# Altium project Z01-2.PrjPcb
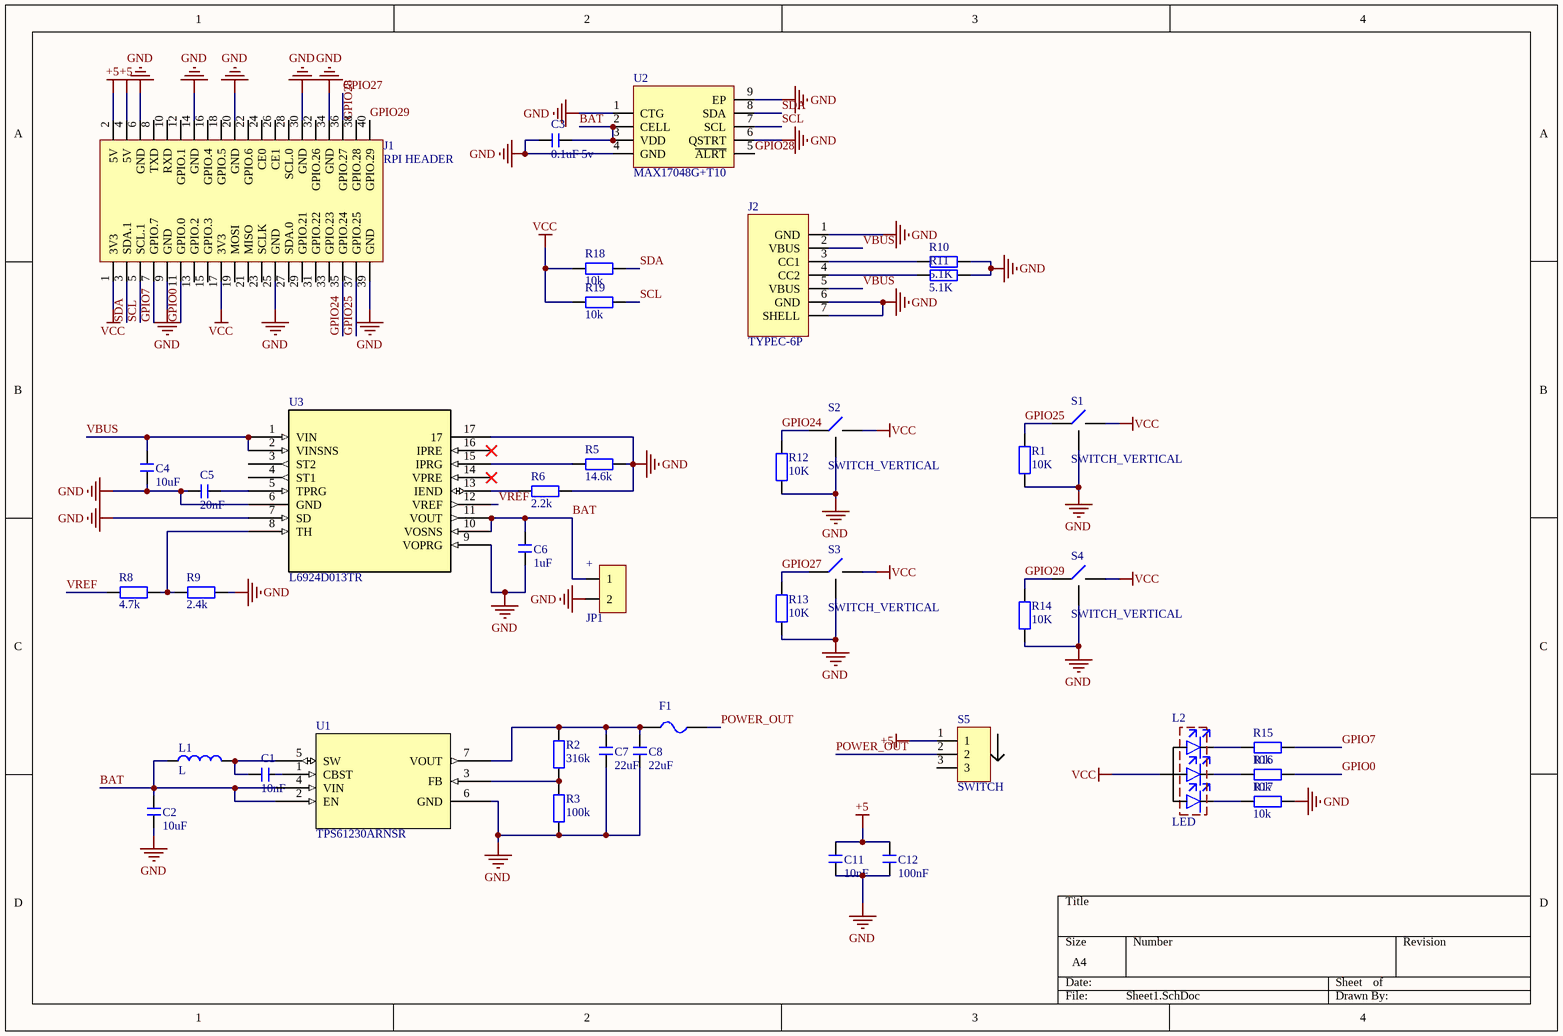
[diagram p0: Sheet1.SchDoc]
1 sheet, 41 parts. Net scope: global (net labels, ports and power ports of the same name join across sheets).
Board file: Z01-2.PcbDoc

## Sheet Sheet1.SchDoc
size A4; SheetNumber: 1; SheetTotal: 1

### Parts
C1  10nF  [C 0603_M]
C2  10uF  [C 0603_M]
C3  0.1uF 5v  [C 0603_M]
C4  10uF  [C 0603_M]
C5  20nF  [C 0603_M]
C6  1uF  [C 0603_M]
C7  22uF  [C 0603_M]
C8  22uF  [C 0603_M]
C11  10nF  [C 0603_M]
C12  100nF  [C 0603_M]
F1  MSMD200-8V 2A  [FU 1206]  (value not drawn)
J1  RPI HEADER  [HEADER 2*20 BACK]
J2  TYPEC-6P  [TYPEC-6P-SMD]
JP1  PH2.0 2P  [PH2.0 2P]  (value not drawn)
L1  L  [L SMD]
L2  LED  [FM-3510RGBA-SG]
R1  10K  [R 0603-HP]
R2  316k  [R 0603-HP]
R3  100k  [R 0603-HP]
R5  14.6k  [R 0603-HP]
R6  2.2k  [R 0603-HP]
R8  4.7k  [R 0603-HP]
R9  2.4k  [R 0603-HP]
R10  5.1K  [R 0603]
R11  5.1K  [R 0603]
R12  10K  [R 0603-HP]
R13  10K  [R 0603-HP]
R14  10K  [R 0603-HP]
R15  10k  [R 0603-HP]
R16  10k  [R 0603-HP]
R17  10k  [R 0603-HP]
R18  10k  [R 0603-HP]
R19  10k  [R 0603-HP]
S1  SWITCH_VERTICAL  [TA3-2W2-V-T/R]
S2  SWITCH_VERTICAL  [TA3-2W2-V-T/R]
S3  SWITCH_VERTICAL  [TA3-2W2-V-T/R]
S4  SWITCH_VERTICAL  [TA3-2W2-V-T/R]
S5  SWITCH  [SWITCH]
U1  TPS61230ARNSR  [VQFN7_2X2_TEX-M]
U2  MAX17048G+T10  [TDFN-8_EP]
U3  L6924D013TR  [VFQFPN-16_STM-M]

### Nets
+5: C11.2 C12.2 J1.2(5V) J1.4(5V) S5.1
GND: C2.2 C3.1 C4.1 C5.1 C6.1 C7.1 C8.1 C11.1 C12.1 J1.6(GND) J1.9(GND) J1.14(GND) J1.20(GND) J1.25(GND) J1.30(GND) J1.34(GND) J1.39(GND) J2.1(GND) J2.6(GND) J2.7(SHELL) JP1.2 R1.2 R3.2 R5.1 R6.1 R9.1 R10.2 R11.2 R12.2 R13.2 R14.2 R17.1 S1.3 S2.3 S3.3 S4.3 U1.6(GND) U2.1(CTG) U2.4(GND) U2.6(QSTRT) U2.9(EP) U3.6(GND) U3.7(SD) U3.9(VOPRG) U3.17
VCC: J1.1(3V3) J1.17(3V3) L2.2(V) R18.1 R19.1 S1.2 S2.2 S3.2 S4.2
BAT: C2.1 C3.2 C6.2 JP1.1 L1.1 U1.2(EN) U1.4(VIN) U2.2(CELL) U2.3(VDD) U3.10(VOSNS) U3.11(VOUT)
GPIO0: J1.11(GPIO.0) R16.1
GPIO7: J1.7(GPIO.7) R15.1
GPIO24: J1.35(GPIO.24) R12.1 S2.1
GPIO25: J1.37(GPIO.25) R1.1 S1.1
GPIO27: J1.36(GPIO.27) R13.1 S3.1
GPIO28: J1.38(GPIO.28) U2.5(~{ALRT})
GPIO29: J1.40(GPIO.29) R14.1 S4.1
POWER_OUT: F1.2 S5.2
SCL: J1.5(SCL.1) R19.2 U2.7(SCL)
SDA: J1.3(SDA.1) R18.2 U2.8(SDA)
VBUS: C4.2 J2.2(VBUS) J2.5(VBUS) U3.1(VIN) U3.2(VINSNS)
VREF: R8.2 U3.12(VREF)
NetC1_1: C1.1 U1.1(CBST)
NetC1_2: C1.2 L1.2 U1.5(SW)
NetC5_2: C5.2 U3.5(TPRG)
NetC7_2: C7.2 C8.2 F1.1 R2.2 U1.7(VOUT)
NetJ2_3: J2.3(CC1) R10.1
NetJ2_4: J2.4(CC2) R11.1
NetL2_1: L2.1(B) R17.2
NetL2_3: L2.3(G) R16.2
NetL2_4: L2.4(R) R15.2
NetR2_1: R2.1 R3.1 U1.3(FB)
NetR5_2: R5.2 U3.15(IPRG)
NetR6_2: R6.2 U3.13(IEND)
NetR8_1: R8.1 R9.2 U3.8(TH)

Not connected (* = marked no-connect by the designer): J1 8(TXD) 10(RXD) 12(GPIO.1) 13(GPIO.2) 15(GPIO.3) 16(GPIO.4) 18(GPIO.5) 19(MOSI) 21(MISO) 22(GPIO.6) 23(SCLK) 24(CE0) 26(CE1) 27(SDA.0) 28(SCL.0) 29(GPIO.21) 31(GPIO.22) 32(GPIO.26) 33(GPIO.23); S5 3; U3 3(ST2) 4(ST1) 14(VPRE)* 16(IPRE)*

### Notes on the sheet
- (in symbol PH2.0 2P) +

### Library data of the parts
C1-C8 C11 C12 = C: 无极性贴片电容; BOM名称: 无极性贴片电容
F1 = FU: 贴片保险丝; 版权归属: 源创客; BOM名称: 贴片保险丝; 学习资源: www.ooocke.com
L2 = RGBLED_VERTICAL
R1-R3 R5 R6 R8-R19 = R: 贴片电阻; 版权归属: 源创客; BOM名称: 贴片电阻; 学习资源: www.ooocke.com
U1 = TPS61230ARNSR: No Description Available; Mfr_Name: Texas Instruments; Copyright: Copyright (C) 2022 Ultra Librarian. All rights reserved.; Manufacturer_Part_Number: TPS61230ARNSR; RefDes: RefDes; Type: DEV
U3 = L6924D013TR: No Description Available; SourceLibrary: Updates_to_database_2020-11-10; Built_By: EMA_UL_Team; Vendor: STMicroelectronics; Manufacturer_Part_Number: L6924D013TR; Copyright: Copyright (C) 2021 Accelerated Designs. All rights reserved; RefDes: RefDes; Type: DEV